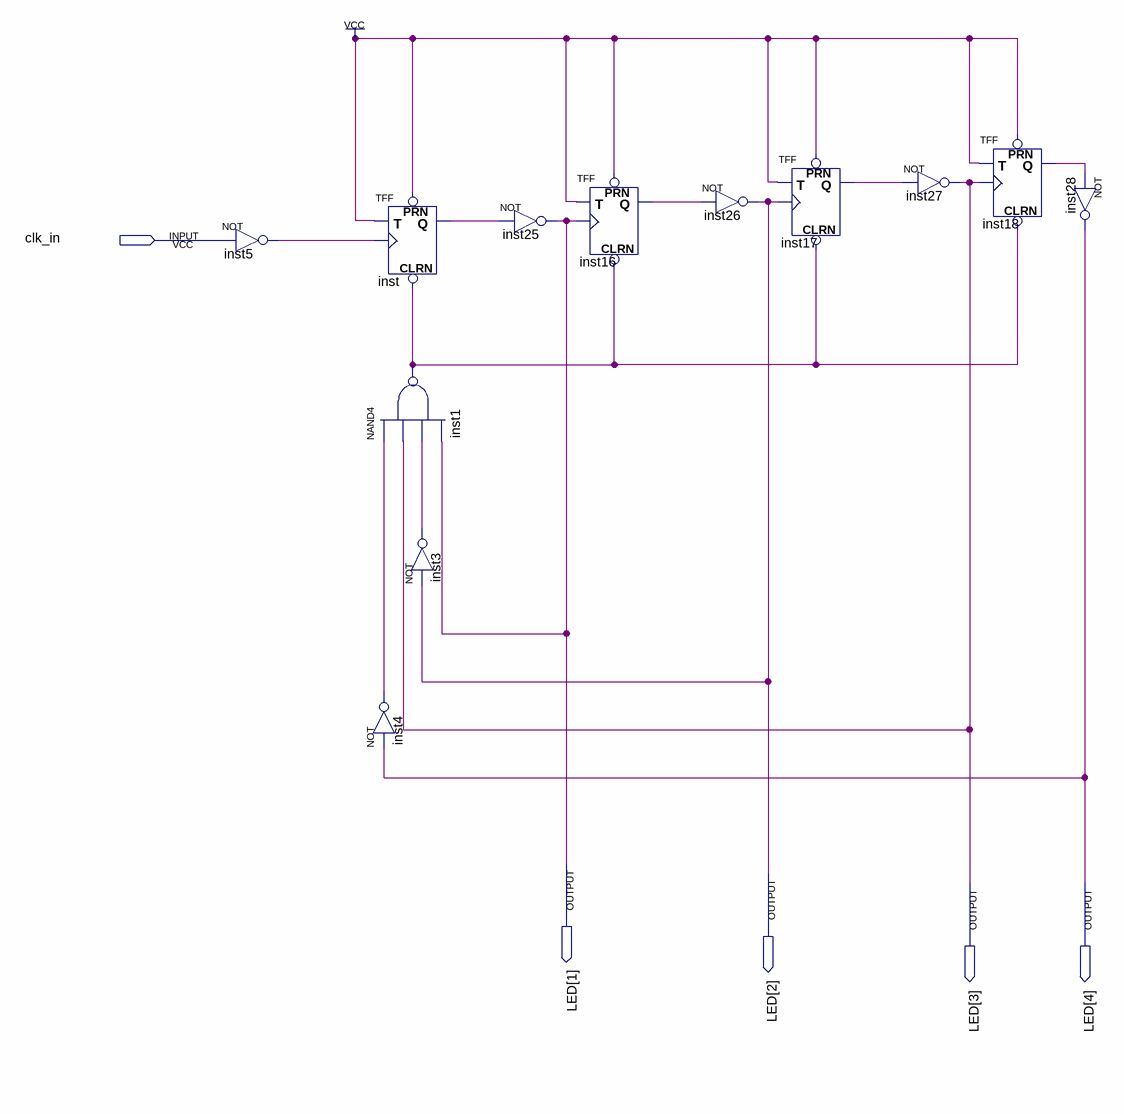
[diagram p0: schematic sheet]
// Quartus schematic contador.bdf as structural Verilog: 12 symbols, 5 pins
module contador (
  input  clk_in,
  output [4:1] LED
);

  wire inst1_out, inst3_out, inst4_out, inst5_out, inst16_q, inst17_q, inst18_q, inst_q;

  not inst5 (inst5_out, clk_in);
  TFF inst (.PRN(1'b1), .CLRN(inst1_out), .T(1'b1), .CLK(inst5_out), .Q(inst_q));
  nand inst1 (inst1_out, inst4_out, LED[3], inst3_out, LED[1]);
  not inst4 (inst4_out, LED[4]);
  not inst3 (inst3_out, LED[2]);
  not inst25 (LED[1], inst_q);
  TFF inst16 (.PRN(1'b1), .CLRN(inst1_out), .T(1'b1), .CLK(LED[1]), .Q(inst16_q));
  not inst26 (LED[2], inst16_q);
  TFF inst17 (.PRN(1'b1), .CLRN(inst1_out), .T(1'b1), .CLK(LED[2]), .Q(inst17_q));
  not inst27 (LED[3], inst17_q);
  TFF inst18 (.PRN(1'b1), .CLRN(inst1_out), .T(1'b1), .CLK(LED[3]), .Q(inst18_q));
  not inst28 (LED[4], inst18_q);
endmodule
